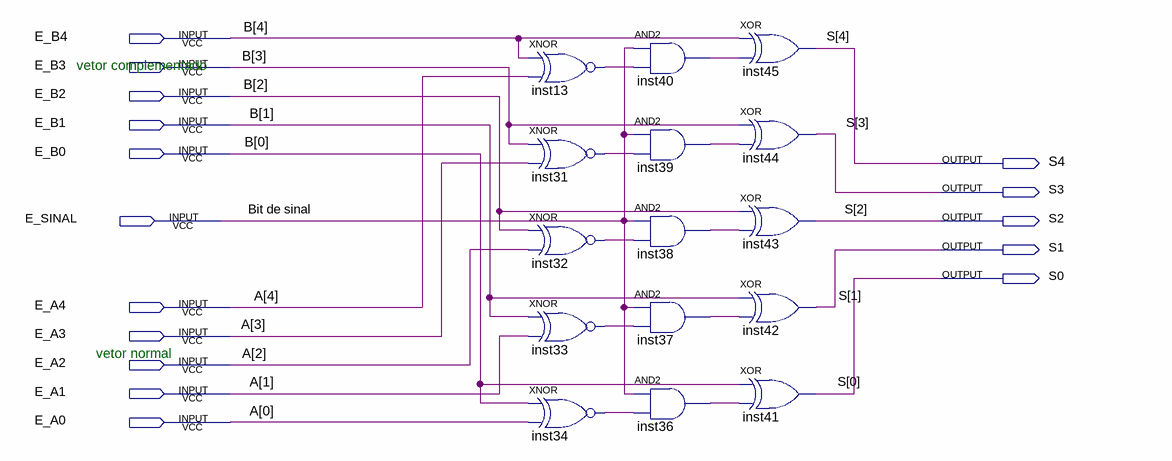
[diagram p0: schematic sheet]
// Quartus schematic mux 2x1.bdf as structural Verilog: 15 symbols, 16 pins
module \mux_2x1  (
  input  E_B4,
  input  E_B3,
  input  E_B2,
  input  E_B1,
  input  E_B0,
  input  E_SINAL,
  input  E_A4,
  input  E_A3,
  input  E_A2,
  input  E_A1,
  input  E_A0,
  output S4,
  output S3,
  output S2,
  output S1,
  output S0
);

  wire inst13_out, inst31_out, inst32_out, inst33_out, inst34_out, inst36_out, inst37_out, inst38_out,
       inst39_out, inst40_out;

  xnor inst13 (inst13_out, E_B4, E_A4);
  xnor inst31 (inst31_out, E_B3, E_A3);
  xnor inst32 (inst32_out, E_B2, E_A2);
  xnor inst33 (inst33_out, E_B1, E_A1);
  xnor inst34 (inst34_out, E_B0, E_A0);
  and inst40 (inst40_out, E_SINAL, inst13_out);
  and inst39 (inst39_out, E_SINAL, inst31_out);
  and inst38 (inst38_out, E_SINAL, inst32_out);
  and inst37 (inst37_out, E_SINAL, inst33_out);
  and inst36 (inst36_out, E_SINAL, inst34_out);
  xor inst45 (S4, E_B4, inst40_out);
  xor inst44 (S3, E_B3, inst39_out);
  xor inst43 (S2, E_B2, inst38_out);
  xor inst42 (S1, E_B1, inst37_out);
  xor inst41 (S0, E_B0, inst36_out);

  // Other names for the same wires on the sheet: A[4:0] = {E_A4, E_A3, E_A2, E_A1, E_A0};
  //   B[4:0] = {E_B4, E_B3, E_B2, E_B1, E_B0}; Bit de sinal = E_SINAL

  // Notes on the sheet:
  //   vetor complementado
  //   vetor normal
endmodule
